# EAGLE board permamote-lte (EAGLE 9.6.1)
REV: C
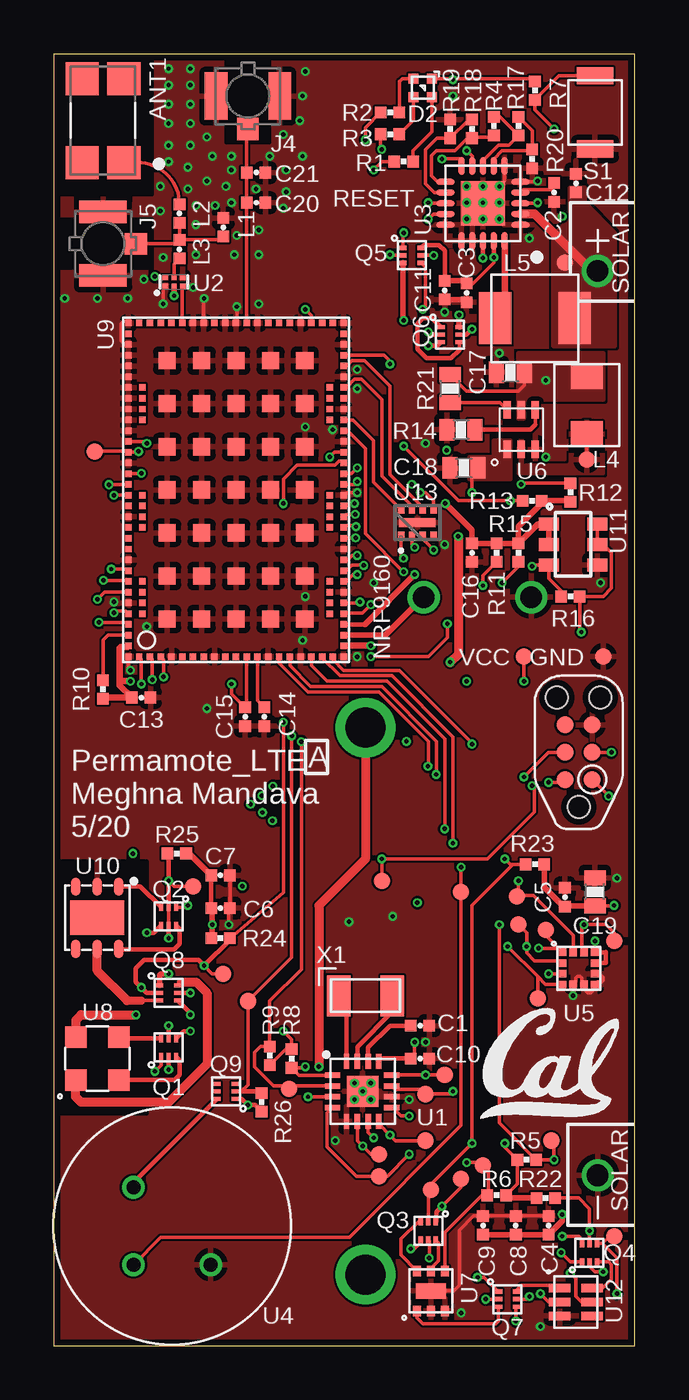
[diagram p5: board, top side]
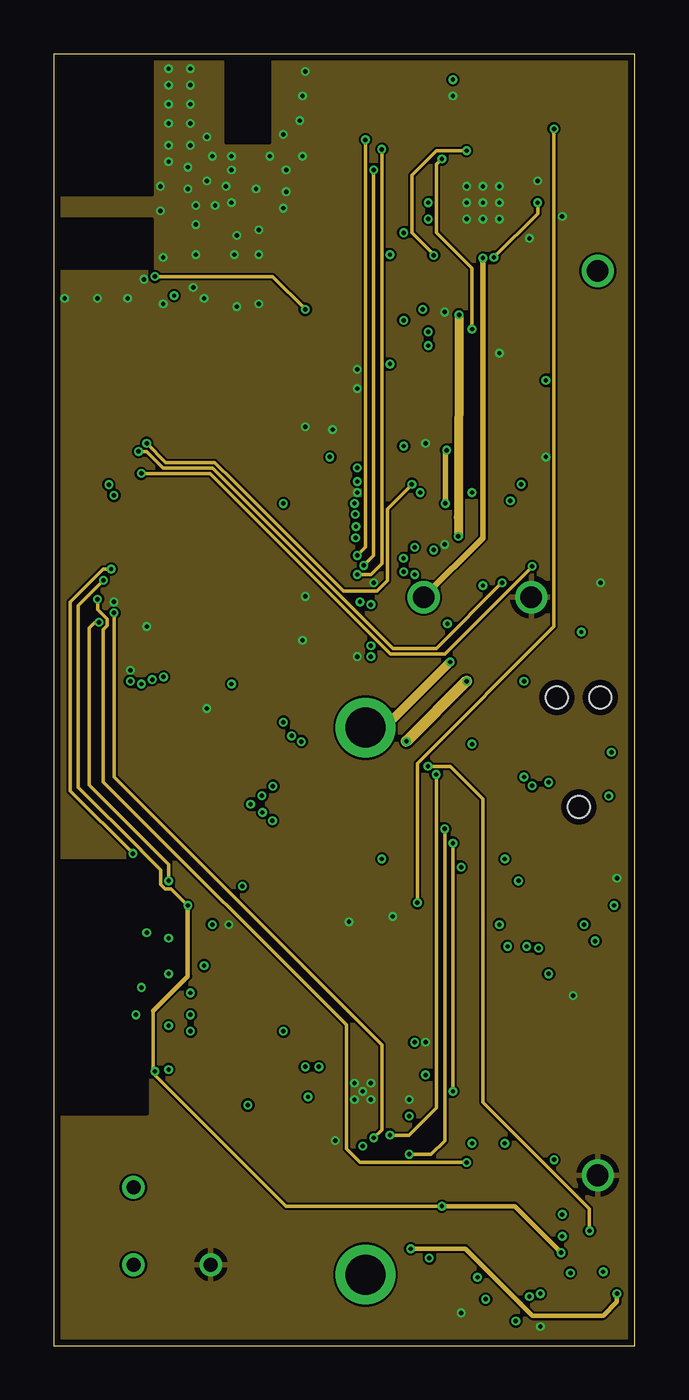
[diagram p6: board, inner layer Route2]
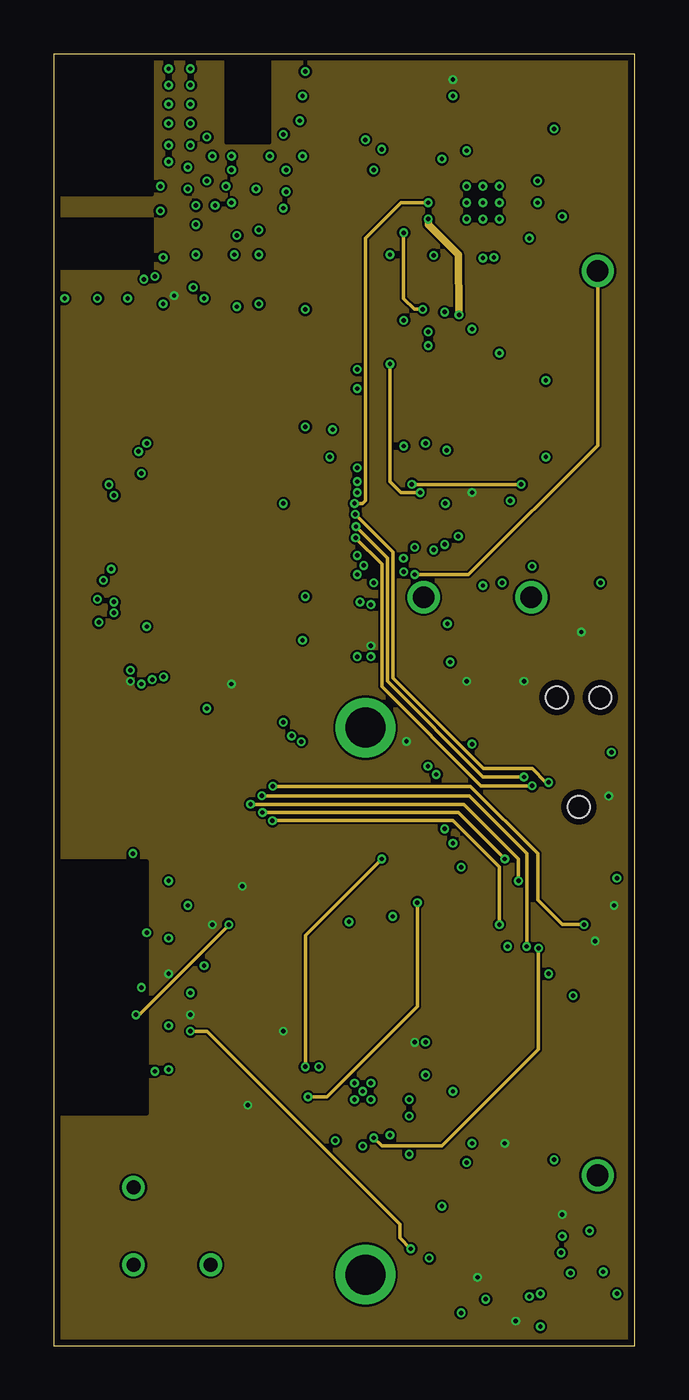
[diagram p7: board, inner layer Route15]
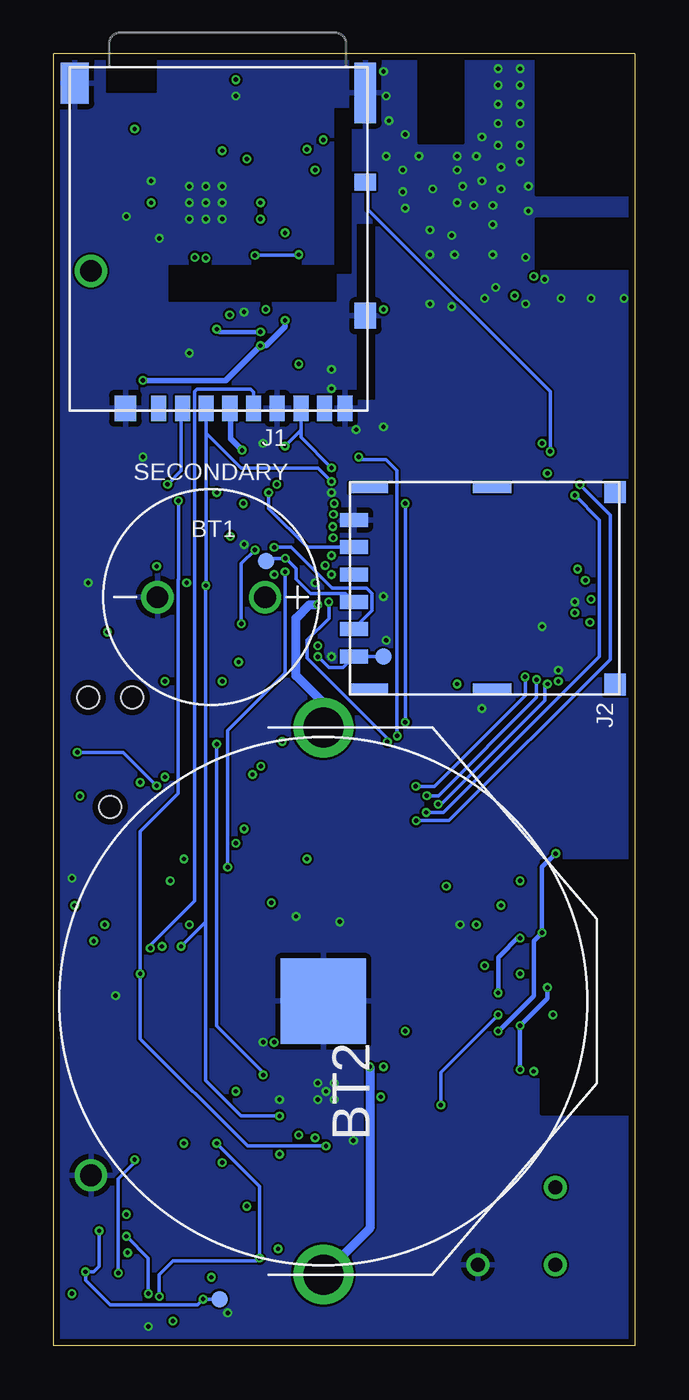
[diagram p8: board, bottom side, seen from below]

Size 27 x 60 mm. Coordinates in mm from the lower left corner, seen from the top.
Outline: 0.5,60 0,60 0,0 27,0 27,60 0.47,60
Copper layers (1+2*15+16): Top 0.0178mm / dielectric 59mil / Route2 0.0356mm / dielectric 0.1499mm / Route15 0.0356mm / dielectric 0.2007mm / Bottom 0.0178mm
Design rules "quickturn_co_kr_1oz_4lyr *": minimum track width 4mil, minimum drill 8mil, track to track 4mil, track to pad 4mil, pad to pad 4mil, via to via 4mil, smd to smd 4mil, copper to edge 12mil, drill to drill 12mil, minimum pad ring 8mil, minimum via ring 4mil, stop-mask expansion 3mil, vias tented up to drill 50mil, thermal gap 10mil
tKeepout: area 24.9,18 to 25.4,18
tRestrict: area 24.4,16.5 to 24.4,17; area 24.9,16.5 to 24.9,17; area 24.9,17 to 25.4,17; area 17.8,1.3 to 17.9,1.9

## Footprints (pad centres in the part's own frame; a part is rotated, then mirrored left to right if it is on the bottom)
ANT_1462350001 = smd 1.54 x 1.54: 1 -1.95,-0.97; 2 1.95,-0.97; 3 1.95,0.97; 4 -1.95,0.97
1020 = drill 1: + -2.5,0; - 2.5,0
2477THMCOINCLIP = drill 1.854: 1 -12.7,0; 2 12.7,0 | smd 3.962 x 3.962: GND 0,0
0402_CAP = smd 0.536 x 0.546: 1 -0.433,0; 2 0.433,0
0603_CAP = smd 0.7 x 1: 1 -0.65,0; 2 0.65,0
SOLAR_HOLES = drill 1: + 0,0; - 42,0
1MM_SQ_4PAD = smd 0.457 x 0.457: 1 0.432,0.432; 2 0.432,-0.432; 3 -0.432,-0.432; 4 -0.432,0.432
DM3AT-SF-PEJM5 = smd 0.7 x 1.2: 1 3.2,-0.1; 2 2.1,-0.1; 3 1,-0.1; 4 -0.1,-0.1; 5 -1.2,-0.1; 6 -2.3,-0.1; 7 -3.4,-0.1; 8 -4.5,-0.1; B -5.45,-0.1 | smd 1 x 0.8: A -6.4,-10.6 | smd 1 x 1.2: MOUNT0 4.75,-0.1; MOUNT1 -6.4,-4.4 | smd 1 x 2.8: MOUNT2 -6.4,-14.75 | smd 1.3 x 1.9: MOUNT3 7.1,-15.2
WURTH_NANO_SIM = smd 0.65 x 1.3: C1 1.905,6.07; C2 -0.635,6.07; C3 -1.905,6.07; C5 3.175,6.07; C6 0.635,6.07; C7 -3.175,6.07 | smd 1.03 x 1: P$8 -4.465,-6.07; P$9 4.465,-6.07 | smd 0.48 x 1.8: P$10 -4.66,-0.35; P$11 4.66,-0.35; P$12 -4.66,5.4; P$13 4.66,5.4
TC2030-IDC-NL = smd 0.787 x 0.787: 1 -1.27,-0.635; 2 -1.27,0.635; 3 0,-0.635; 4 0,0.635; 5 1.27,-0.635; 6 1.27,0.635 | hole 1.016: -2.54,0; 2.54,1.016; 2.54,-1.016
U.FL_SMT = smd 1.05 x 2.2: GND1 -1.475,0; GND2 1.475,0 | smd 1 x 1.05: SIG 0,-1.525
IHL-1212BZ-11 = smd 1.2 x 1.5: P$1 -1.35,0; P$2 1.35,0
74437324220 = smd 1.5 x 2.4: P$1 1.85,0; P$2 -1.85,0
XDFN-6 = smd 0.35 x 0.2: 1 -0.425,0.35; 2 -0.425,0; 3 -0.425,-0.35; 4 0.425,-0.35; 5 0.425,0; 6 0.425,0.35
0402_RES = smd 0.536 x 0.546: 1 -0.433,0; 2 0.433,0
0603-RES = smd 0.7 x 1: 1 -0.65,0; 2 0.65,0
B3U-1000P = smd 0.8 x 1.7: 1 -1.7,0; 2 1.7,0
PAD.03X.03 = smd 0.762 x 0.762: P$1 0,0
QFN-16-3MM = smd 0.7 x 0.25: 1 -1.4,0.75; 2 -1.4,0.25; 3 -1.4,-0.25; 4 -1.4,-0.75; 9 1.35,-0.75; 10 1.35,-0.25; 11 1.35,0.25; 12 1.35,0.75 | smd 0.25 x 0.7: 5 -0.75,-1.4; 6 -0.25,-1.4; 7 0.25,-1.4; 8 0.75,-1.4; 13 0.75,1.4; 14 0.25,1.4; 15 -0.25,1.4; 16 -0.75,1.4 | smd 1.45 x 1.45: GND 0,0
LNA-TSLP-6-2-ORIG = smd 0.25 x 0.25: 1 -0.2,0.4; 2 -0.2,0; 3 -0.2,-0.4; 4 0.2,-0.4; 5 0.2,0; 6 0.2,0.4
S-PVQFN-N20-RGR = smd 0.28 x 0.85: 1 -1,-1.74; 2 -0.5,-1.74; 3 0,-1.74; 4 0.5,-1.74; 5 1,-1.74; 11 1,1.74; 12 0.5,1.74; 13 0,1.74; 14 -0.5,1.74; 15 -1,1.74 | smd 0.85 x 0.28: 6 1.74,-1; 7 1.74,-0.5; 8 1.74,0; 9 1.74,0.5; 10 1.74,1; 16 -1.74,1; 17 -1.74,0.5; 18 -1.74,0; 19 -1.74,-0.5; 20 -1.74,-1 | smd 2.05 x 2.05: PAD 0,0
AMN2 = drill 0.65: GND 1.796,-1.796; OUT -1.796,-1.796; VCC -1.796,1.796
LGA-12 = smd 0.375 x 0.35: 1 -0.75,0.75; 2 -0.75,0.25; 3 -0.75,-0.25; 4 -0.75,-0.75; 7 0.75,-0.75; 8 0.75,-0.25; 9 0.75,0.25; 10 0.75,0.75 | smd 0.35 x 0.375: 5 -0.25,-0.75; 6 0.25,-0.75; 11 0.25,0.75; 12 -0.25,0.75
UDFN-6-MAXIM = smd 0.8 x 0.35: 1 -0.915,0.65; 2 -0.915,0; 3 -0.915,-0.65; 4 0.915,-0.65; 5 0.915,0; 6 0.915,0.65
UDFN-6-EXPOSED = smd 0.48 x 0.36: 1 -0.925,0.65; 2 -0.925,0; 3 -0.925,-0.65; 4 0.925,-0.65; 5 0.925,0; 6 0.925,0.65 | smd 0.71 x 1.4: EP 0,0
4-SMD = smd 1 x 1: 1 -1,1; 2 -1,-1; 3 1,-1; 4 1,1
NRF9160 = smd 0.3 x 0.3: ANT 15.75,4.75; AUX 15.75,6.25; COEX0 5.25,10.25; COEX1 5.75,10.25; COEX2 6.25,10.25; ENABLE 1.25,10.25; GND_SHIELD@1 0.25,10.25; GND_SHIELD@2 0.25,8.25; GND_SHIELD@3 0.25,6.25; GND_SHIELD@4 0.25,3.75; GND_SHIELD@5 0.25,2.25; GND_SHIELD@6 0.25,0.25; GND_SHIELD@7 3.25,0.25; GND_SHIELD@8 5.25,0.25; GND_SHIELD@9 7.75,0.25; GND_SHIELD@10 10.25,0.25; GND_SHIELD@11 11.75,0.25; GND_SHIELD@12 13.25,0.25; GND_SHIELD@13 14.75,0.25; GND_SHIELD@14 15.75,0.25; GND_SHIELD@15 15.75,2.25; GND_SHIELD@16 15.75,4.25; GND_SHIELD@17 15.75,5.25; GND_SHIELD@18 15.75,5.75; GND_SHIELD@19 15.75,6.75; GND_SHIELD@20 15.75,7.25; GND_SHIELD@21 15.75,10.25; GND_SHIELD@22 14.75,10.25; GND_SHIELD@23 14.25,10.25; GND_SHIELD@24 13.75,10.25; GND_SHIELD@25 13.25,10.25; GND_SHIELD@26 12.75,10.25; GND_SHIELD@27 12.25,10.25; GND_SHIELD@28 11.75,10.25; GND_SHIELD@29 11.25,10.25; GND_SHIELD@30 10.75,10.25; GND_SHIELD@31 9.25,10.25; GND_SHIELD@32 6.75,10.25; GND_SHIELD@33 4.75,10.25; GND_SHIELD@34 2.75,10.25; GPS 15.75,7.75; IO_SUPPLY 0.25,4.25; MAGPIO0 15.75,1.75; MAGPIO1 15.75,1.25; MAGPIO2 15.75,0.75; NC1 0.25,7.75; NC2 0.25,7.25; NC3 0.25,6.75; NC4 0.25,5.75; NC5 0.25,5.25; NC6 15.25,0.25; NC7 15.75,8.25; NC8 15.75,8.75; NC9 15.75,9.25; NC10 15.75,9.75; NC11 15.25,10.25; NC12 2.25,0.9; NC13 2.75,0.9; NC14 3.25,0.9; NC15 3.75,0.9; NC16 6.25,0.9; NC17 6.75,0.9; NC18 7.25,0.9; NC19 7.75,0.9; NC20 11.25,0.9; NC21 11.75,0.9; NC22 12.25,0.9; NC23 12.75,0.9; NC24 12.75,9.6; NC25 12.25,9.6; NC26 11.75,9.6; NC27 11.25,9.6; NC28 7.75,9.6; NC29 7.25,9.6; NC30 6.75,9.6; NC31 6.25,9.6; NC32 3.75,9.6; NC33 3.25,9.6; NC34 2.75,9.6; NC35 2.25,9.6; NRESET 5.75,0.25; P0.00 4.25,10.25; P0.01 3.75,10.25; P0.02 3.25,10.25; P0.03 2.25,10.25; P0.04 1.75,10.25; P0.05 0.25,9.75; P0.06 0.25,9.25; P0.07 0.25,8.75; P0.08 0.25,3.25; P0.09 0.25,2.75; P0.10 0.25,1.75; P0.11 0.25,1.25; P0.12 0.25,0.75; P0.13 1.25,0.25; P0.14 1.75,0.25; P0.15 2.25,0.25; P0.16 2.75,0.25; P0.17 3.75,0.25; P0.18 4.25,0.25; P0.19 4.75,0.25; P0.20 7.25,0.25; P0.21 8.25,0.25; P0.22 8.75,0.25; P0.23 9.25,0.25; P0.24 9.75,0.25; P0.25 10.75,0.25; P0.26 10.25,10.25; P0.27 9.75,10.25; P0.28 8.75,10.25; P0.29 8.25,10.25; P0.30 7.75,10.25; P0.31 7.25,10.25; SCLK 15.75,3.25; SDATA 15.75,3.75; SIM_1V8 14.25,0.25; SIM_CLK 12.75,0.25; SIM_DET 12.25,0.25; SIM_IO 13.75,0.25; SIM_RST 11.25,0.25; SWDCLK 6.25,0.25; SWDIO 6.75,0.25; VDD@1 0.75,0.25; VDD@2 0.75,10.25; VDD_GPIO 0.25,4.75; VIO 15.75,2.75 | smd 0.8 x 0.8: GND@1 2,8.45; GND@2 4,8.45; GND@3 6,8.45; GND@4 8,8.45; GND@5 10,8.45; GND@6 12,8.45; GND@7 14,8.45; GND@8 2,6.85; GND@9 4,6.85; GND@10 6,6.85; GND@11 8,6.85; GND@12 10,6.85; GND@13 12,6.85; GND@14 14,6.85; GND@15 2,5.25; GND@16 4,5.25; GND@17 6,5.25; GND@18 8,5.25; GND@19 10,5.25; GND@20 12,5.25; GND@21 14,5.25; GND@22 2,3.65; GND@23 4,3.65; GND@24 6,3.65; GND@25 8,3.65; GND@26 10,3.65; GND@27 12,3.65; GND@28 14,3.65; GND@29 2,2.05; GND@30 4,2.05; GND@31 6,2.05; GND@32 8,2.05; GND@33 10,2.05; GND@34 12,2.05; GND@35 14,2.05
DFN-6/3MM = smd 0.85 x 0.45: 1 -1.45,1; 2 -1.45,0; 3 -1.45,-1; 4 1.45,-1; 5 1.45,0; 6 1.45,1 | smd 1.6 x 2.5: P$1 0,0
TSOT23-6 = smd 0.6 x 0.927: 1 -0.95,-1.126; 2 0,-1.126; 3 0.95,-1.126; 4 0.95,1.126; 5 0,1.126; 6 -0.95,1.126
FN-6 = smd 1 x 0.4: 1 -0.75,0.65; 2 -0.75,0; 3 -0.75,-0.65; 4 0.75,-0.65; 5 0.75,0; 6 0.75,0.65
DPV8_1P7X0P4 = smd 0.38 x 0.3: 1 -0.61,0.75; 2 -0.61,0.25; 3 -0.61,-0.25; 4 -0.61,-0.75; 5 0.61,-0.75; 6 0.61,-0.25; 7 0.61,0.25; 8 0.61,0.75 | smd 0.4 x 1.7: 9 0,0
2-SMD = smd 1.092 x 1.905: 1 -1.245,0; 2 1.245,0

## Placement (x,y rotation side)
ANT1  1462350001  [ANT_1462350001]  2.29,56.9 90 top
BT1  LTOHTC1020  [1020]  19.68,34.77 180 bottom
BT2  2477THMCOINCELLCLIP  [2477THMCOINCLIP]  14.48,16 90 bottom
C1  47pF  [0402_CAP]  17.02,14.86 0 top
C2  10nF  [0402_CAP]  23.24,53.56 270 top
C3  10nF  [0402_CAP]  19.18,48.9 270 top
C4  0.1uF  [0402_CAP]  22.99,5.59 90 top
C5  0.1uF  [0402_CAP]  23.75,20.83 90 top
C6  0.1uF  [0402_CAP]  7.75,20.32 0 top
C7  0.1uF  [0402_CAP]  7.75,21.84 0 top
C8  1uF  [0402_CAP]  21.46,5.59 90 top
C9  1uF  [0402_CAP]  19.94,5.59 90 top
C10  1uF  [0402_CAP]  17.02,13.34 0 top
C11  4.7uF  [0402_CAP]  18.16,49.02 270 top
C12  4.7uF  [0402_CAP]  24.26,53.99 90 top
C13  4.7uF  [0402_CAP]  4.06,30.1 0 top
C14  4.7uF  [0402_CAP]  9.78,29.21 270 top
C15  4.7uF  [0402_CAP]  8.89,29.21 270 top
C16  4.7uF  [0402_CAP]  19.43,36.83 270 top
C17  10uF  [0603_CAP]  21.21,45.21 180 top
C18  10uF  [0603_CAP]  19.05,40.77 180 top
C19  10uF  [0603_CAP]  25.15,21.08 90 top
C20  DNP  [0402_CAP]  9.4,53.09 180 top
C21  DNP  [0402_CAP]  9.4,54.48 180 top
D1  SOLARCELLHOLES  [SOLAR_HOLES]  25.27,49.91 270 top
D2  SML-LX0404SIUPGUSB  [1MM_SQ_4PAD]  17.14,58.42 0 top
J1  DM3AT-SF-PEJM5  [DM3AT-SF-PEJM5]  18.92,43.43 180 bottom
J2  NANO_SIM  [WURTH_NANO_SIM]  6.99,35.18 90 bottom
J3  TC2030-JLINK-NL  [TC2030-IDC-NL]  24.38,27.56 90 top
J4  U.FL-R-SMT  [U.FL_SMT]  9.02,58.04 0 top
J5  U.FL-R-SMT  [U.FL_SMT]  2.29,51.18 90 top
L1  1.8nH  [0402_CAP]  7.87,51.94 270 top
L2  5.1nH  [0402_CAP]  5.84,52.58 90 top
L3  7.5nH  [0402_CAP]  5.84,50.93 90 top
L4  1uH  [IHL-1212BZ-11]  24.77,43.69 270 top
L5  22uH  [74437324220]  22.35,47.72 180 top
Q1  PMDXB950UPEL  [XDFN-6]  5.33,13.84 90 top
Q2  PMDXB950UPEL  [XDFN-6]  5.33,19.94 270 top
Q3  PMDXB950UPEL  [XDFN-6]  17.4,5.33 270 top
Q4  PMDXB950UPEL  [XDFN-6]  24.89,4.32 90 top
Q5  PMDXB950UPEL  [XDFN-6]  16.64,50.64 0 top
Q6  PMDXB950UPEL  [XDFN-6]  18.41,46.96 0 top
Q7  PMDXB950UPEL  [XDFN-6]  21.08,2.16 0 top
Q8  PMDXB950UPEL  [XDFN-6]  5.33,16.38 0 top
Q9  PMDXB950UPEL  [XDFN-6]  8,11.81 180 top
R1  470  [0402_RES]  16.26,54.99 180 top
R2  470  [0402_RES]  15.62,57.28 180 top
R3  470  [0402_RES]  15.62,56.26 180 top
R4  6.04k  [0402_RES]  20.45,56.64 90 top
R5  10k  [0402_RES]  21.97,8.64 180 top
R6  10k  [0402_RES]  20.57,6.99 0 top
R7  10k  [0402_RES]  22.35,58.29 90 top
R8  10k  [0402_RES]  11.05,13.34 90 top
R9  10k  [0402_RES]  10.03,13.46 270 top
R10  10k  [0402_RES]  2.29,30.48 90 top
R11  10k  [0402_RES]  20.57,36.83 90 top
R12  10k  [0402_RES]  24,39.62 270 top
R13  10k  [0402_RES]  22.23,39.24 0 top
R14  80.6k  [0603-RES]  18.92,42.55 0 top
R15  100k  [0402_RES]  21.59,36.83 90 top
R16  100k  [0402_RES]  24,34.8 0 top
R17  3.9M  [0402_RES]  21.59,56.64 270 top
R18  6.2M  [0402_RES]  19.43,56.52 270 top
R19  6.8M  [0402_RES]  18.41,56.52 270 top
R20  9.1M  [0402_RES]  22.23,55.12 90 top
R21  33M  [0603-RES]  18.41,44.45 90 top
R22  100M  [0402_RES]  22.86,6.86 180 top
R23  100M  [0402_RES]  22.35,22.35 0 top
R24  100M  [0402_RES]  7.75,18.92 180 top
R25  100M  [0402_RES]  5.71,22.86 0 top
R26  100M  [0402_RES]  9.65,11.3 270 top
S1  B3U-1000P  [B3U-1000P]  25.15,57.28 90 top
TP1  TEST-POINT  [PAD.03X.03]  26.04,5.08 0 top
TP2  TEST-POINT  [PAD.03X.03]  18.92,7.75 0 top
TP3  TEST-POINT  [PAD.03X.03]  22.86,19.3 270 top
TP4  TEST-POINT  [PAD.03X.03]  15.11,8.89 0 top
TP5  TEST-POINT  [PAD.03X.03]  22.48,16.13 90 top
TP6  TEST-POINT  [PAD.03X.03]  18.16,12.57 0 top
TP7  TEST-POINT  [PAD.03X.03]  21.59,19.56 90 top
TP8  TEST-POINT  [PAD.03X.03]  7.87,17.27 0 top
TP9  TEST-POINT  [PAD.03X.03]  19.3,2.16 0 bottom
TP10  TEST-POINT  [PAD.03X.03]  17.53,7.24 0 top
TP11  TEST-POINT  [PAD.03X.03]  9.02,16 0 top
TP12  TEST-POINT  [PAD.03X.03]  6.48,21.34 0 top
TP13  TEST-POINT  [PAD.03X.03]  17.27,11.68 90 top
TP14  TEST-POINT  [PAD.03X.03]  15.11,7.87 0 top
TP15  TEST-POINT  [PAD.03X.03]  17.27,9.53 0 top
TP16  TEST-POINT  [PAD.03X.03]  10.92,11.94 0 top
TP17  TEST-POINT  [PAD.03X.03]  15.24,21.59 0 top
TP18  TEST-POINT  [PAD.03X.03]  21.51,20.87 0 top
TP19  TEST-POINT  [PAD.03X.03]  26.04,18.8 270 top
TP20  TEST-POINT  [PAD.03X.03]  23.11,9.53 0 top
TP21  TEST-POINT  [PAD.03X.03]  19.94,8.38 0 top
TP22  TEST-POINT  [PAD.03X.03]  18.92,21.08 90 top
TP23  TEST-POINT  [PAD.03X.03]  23.75,50.29 0 top
TP24  TEST-POINT  [PAD.03X.03]  24.77,41.15 0 top
TP25  TEST-POINT  [PAD.03X.03]  21.84,32 0 top
TP26  TEST-POINT  [PAD.03X.03]  25.53,32 0 top
TP27  TEST-POINT  [PAD.03X.03]  17.14,36.45 0 bottom
TP28  TEST-POINT  [PAD.03X.03]  11.68,32 270 bottom
TP29  TEST-POINT  [PAD.03X.03]  1.91,41.53 0 top
U1  AB1815-T3  [QFN-16-3MM]  14.35,11.81 0 top
U2  BGA725L6  [LNA-TSLP-6-2-ORIG]  5.59,49.4 90 top
U3  BQ25505  [S-PVQFN-N20-RGR]  19.94,53.05 90 top
U4  EKMB1101111  [AMN2]  5.5,5.56 0 top
U5  LIS2DW12  [LGA-12]  24.38,17.53 0 top
U6  MAX17222  [UDFN-6-MAXIM]  21.72,42.55 90 top
U7  MAX44009  [UDFN-6-EXPOSED]  17.53,2.54 90 top
U8  MS5637-02BA03  [4-SMD]  2.03,13.34 90 top
U9  NRF9160  [NRF9160]  13.72,31.75 90 top
U10  SI7021-A20-GM1  [DFN-6/3MM]  2.02,19.88 270 top
U11  SIP32510  [TSOT23-6]  24.13,37.21 270 top
U12  TCS34725  [FN-6]  24.26,2.03 0 top
U13  TPD3F303DPVR  [DPV8_1P7X0P4]  16.89,38.23 90 top
U$2  [UCB_CAL_200MIL]  19.81,10.54 0 top
X1  ABS07-32.768KHZ-7-T  [2-SMD]  14.48,16.26 0 top

## Tracks (layer width: path | path; a pad name or v marks a point on that pad's centre or on a via)
!CLR_EN  (via drill 0.2)
  Top 0.152: v25.53,3.43 25.15,3.43 24.89,3.68 Q4.2 | Q4.5 v24.89,5.33 24.89,6.35 24.38,6.86 R22.1 | U9.P0.08 10.47,31.7 11.81,30.35 15.11,30.35 17.4,28.07 17.4,26.92 v17.38,26.91 | Q7.2 v20.07,2.16
  Route2 0.152: v17.38,26.91 18.43,26.91 19.94,25.4 19.94,11.3 24.89,6.35 v24.89,5.33
  Bottom 0.152: v24.89,5.33 24.89,3.68 25.15,3.43 v25.53,3.43 25.53,3.05 24.38,1.91 20.32,1.91 v20.07,2.16 TP9.P$1
!CLR_INT  (via drill 0.2)
  Top 0.152: U12.5 24.51,2.03 24.26,2.29 24.26,3.12 v24,3.38 | U9.P0.29 v2.56,40 v2.56,39.99 | TP20.P$1 23.24,9.4 v23.24,8.64 R5.1 20.7,10.34 v20.7,19.56
  Route15 0.152: v20.7,19.56 20.7,22.23 18.54,24.38 v10.16,24.38
  Bottom 0.152: v23.24,8.64 23.24,8.51 24,7.75 v24,3.38 | v2.56,39.99 1.14,38.58 1.14,31.88 8.64,24.38 v10.16,24.38
!HUM_EN  (via drill 0.2)
  Top 0.152: v2.09,33.59 3.37,33.59 U9.P0.04 | TP12.P$1 5.59,21.34 v5.33,21.59 | Q2.2 Q2.5
  Top 0.203: Q2.5 v5.33,18.92 | Q8.5 v6.35,16.38 | Q2.2 v5.33,21.59 5.33,22.81 R25.1
  Route2 0.152: v2.09,33.59 1.91,33.59 1.65,33.34 1.65,26.04 5.33,22.35 v5.33,21.59
  Bottom 0.203: v5.33,18.92 5.33,19.05 6.35,18.03 v6.35,16.38
!LT_EN  (via drill 0.2)
  Top 0.152: Q3.5 17.44,4.86 v17.44,4.06 | v22.1,2.29 21.97,2.16 Q7.5 | Q3.2 17.4,7.11 TP10.P$1 17.53,7.49 v19.43,9.4 19.43,20.45 21.34,22.35 | R23.1 21.34,22.35 | 21.34,22.35 21.21,22.35 v20.95,22.61 | U9.P0.30 v2.79,39.5
  Route15 0.152: v20.95,22.61 18.8,24.77 v9.7,24.77
  Bottom 0.152: v19.43,9.4 17.44,7.41 v17.44,4.06 17.57,3.94 21.46,3.94 22.1,3.3 v22.1,2.29 | v2.79,39.5 1.65,38.35 1.65,32 8.89,24.77 v9.7,24.77
!LT_INT  (via drill 0.2)
  Top 0.152: U7.4 18.18,5.27 19.89,6.99 R6.1 20.19,7.04 20.19,8.13 TP21.P$1 19.81,8.51 v19.18,8.51 | U9.P0.02 2.36,35 v2.03,34.67
  Route2 0.152: v2.03,34.67 2.03,34.19 2.47,33.75 2.47,33.44 2.29,33.25 2.29,26.19 13.59,14.89 13.59,9.14 14.22,8.51 v19.18,8.51
!PIR_EN  (via drill 0.2)
  Top 0.152: U9.P0.24 13.05,41.5 v12.83,41.27 | v11.05,28.32 11.05,18.03 TP11.P$1 9.02,12.12 8.71,11.81 Q9.2
  Top 0.203: Q9.2 9.58,11.81 R26.1
  Bottom 0.152: v11.05,28.32 11.05,40.64 11.56,41.15 12.7,41.15 v12.83,41.27
!PR_EN  (via drill 0.2)
  Top 0.152: v6.99,17.65 7.37,17.27 TP8.P$1 | R24.1 10.67,21.06 v10.67,28.96 | U9.P0.23 13.38,41.08 13.24,41.08 13.05,40.89 11.3,40.89 10.67,40.26 v10.67,39.12
  Top 0.203: Q1.5 v5.33,14.86 | Q1.2 v5.33,12.83 | Q8.2 4.32,16.38 v4.06,16.64 3.81,16.89 3.81,17.53 4.19,17.91 6.73,17.91 v6.99,17.65 8.18,18.85 R24.1
  Bottom 0.152: v10.67,39.12 v10.67,28.96
  Bottom 0.203: v5.33,12.83 v5.33,14.86 4.06,16.13 v4.06,16.64
!RST  (via drill 0.2)
  Top 0.152: U1.1 11.39,12.56 R8.1 11.63,12.9 v11.68,12.95 | U9.NRESET 13.48,37.52 v14.02,37.52 | TP17.P$1 v15.24,22.61 20.15,22.61 22.33,24.79 22.33,25.9 v22.23,26 | v25.91,27.56 J3.3
  Route15 0.152: v14.02,37.52 15.24,36.3 15.24,30.61 19.84,26 v22.23,26 | v15.24,22.61 11.68,19.05 v11.68,12.95
  Bottom 0.152: v22.23,26 23.78,27.56 v25.91,27.56
!RTC_EXTR  (via drill 0.2)
  Top 0.152: v23.24,56.52 22.35,57.4 R7.1 23.47,58.98 S1.2 | U1.3 v11.81,11.56
  Route2 0.152: v23.24,56.52 23.24,33.4 16.89,27.05 v16.89,20.57
  Route15 0.152: v16.89,20.57 16.89,15.75 12.7,11.56 v11.81,11.56
!RTC_IRQ1  (via drill 0.2)
  Top 0.152: U1.11 15.85,11.91 17.04,11.91 TP13.P$1 18.41,11.68 v18.54,11.81 | U9.P0.11 12.47,31.95 13.3,31.11 15.7,31.11 18.54,28.28 v18.54,23.34
  Route2 0.152: v18.54,23.34 v18.54,11.81
!RTC_IRQ2  (via drill 0.2)
  Top 0.152: U9.P0.10 11.97,31.59 12.7,30.86 15.47,30.86 18.16,28.17 v18.16,24 | U1.4 12.7,10.81 12.7,9.24 14.07,7.87 TP14.P$1 15.49,7.87 v16.51,8.89
  Route2 0.152: v18.16,24 18.16,9.53 17.53,8.89 v16.51,8.89
!RTC_IRQ3  (via drill 0.2)
  Top 0.152: U1.8 15.1,10.3 v15.62,9.78 15.88,9.53 TP15.P$1 | v17.77,26.53 17.78,26.54 17.78,28.07 15.24,30.61 11.94,30.61 10.97,31.58 U9.P0.09
  Route2 0.152: v17.77,26.53 17.78,26.53 17.78,11.05 16.51,9.78 v15.62,9.78
!SD_CS  (via drill 0.2)
  Top 0.152: v4.32,41.91 4.23,42 U9.P0.26 | R12.1 21.77,40.06 v21.72,40.01
  Route2 0.152: v4.32,41.91 5.21,41.02 7.48,41.02 8.37,40.13 8.38,40.13 13.46,35.05 15.02,35.05 15.49,35.53 15.49,38.86 v16.64,40.01
  Route15 0.152: v21.72,40.01 v16.64,40.01
  Bottom 0.152: J1.2 21.08,43.48 21.08,40.64 v21.72,40.01
!SD_DETECT  (via drill 0.2)
  Top 0.152: v3.94,41.53 3.91,41.5 U9.P0.27 3.42,41.55 1.92,41.55 TP29.P$1 | R15.1 21.59,36.19 v20.83,35.43
  Route2 0.152: v3.94,41.53 4.32,41.53 5.08,40.77 7.38,40.77 15.76,32.38 17.78,32.38 v20.83,35.43
  Bottom 0.152: J1.A 12.4,53.91 12.4,52.76 3.94,44.3 v3.94,41.53
!VBAT_PRI_ON  (via drill 0.2)
  Top 0.152: v18.03,55.12 18.94,55.12 U3.10
  Top 0.203: Q6.2 17.53,46.96 v17.4,47.09 | v19.43,47.21 19.18,46.96 Q6.5
  Route2 0.152: v19.43,47.21 19.43,50.04 17.78,51.69 17.78,54.86 v18.03,55.12
  Bottom 0.203: v17.4,47.09 19.3,47.09 v19.43,47.21
!VBAT_SEC_ON  (via drill 0.2)
  Top 0.152: Q5.5 v17.65,50.64 | v19.18,55.5 19.44,55.24 U3.9 | v15.62,50.67 15.65,50.64 Q5.2
  Route2 0.152: v19.18,55.5 17.78,55.5 16.64,54.36 16.64,51.69 17.65,50.67 v17.65,50.64
  Bottom 0.152: v17.65,50.64 15.65,50.64 v15.62,50.67
ACC_CS  (via drill 0.2)
  Top 0.152: U5.2 23.54,17.87 22.34,17.87 21.97,18.24 v21.97,18.54 21.97,19.18 TP7.P$1 | U9.P0.06 4.57,31.89 v4.57,30.93
  Route15 0.152: v21.97,18.54 21.97,22.86 19.3,25.53 9.67,25.53 v9.67,25.54
  Bottom 0.152: v4.57,30.93 4.57,30.1 9.13,25.54 v9.67,25.54
ACC_INT1  (via drill 0.2)
  Top 0.152: U5.12 24.13,19.05 22.28,20.9 21.54,20.9 TP18.P$1 21.59,20.95 v21.59,21.59 | U9.P0.05 4.06,31.9 v4.06,30.73
  Route15 0.152: v9.14,25.15 19.05,25.15 21.59,22.61 v21.59,21.59
  Bottom 0.152: v4.06,30.73 4.19,30.61 4.19,29.97 9.02,25.15 v9.14,25.15
ACC_INT2  (via drill 0.2)
  Top 0.152: U5.11 24.54,18.37 24.54,19.46 v24.64,19.56 25.65,19.56 26.04,19.18 TP19.P$1 | U9.P0.07 5.1,31.87 v5.1,31.06
  Route15 0.152: v10.18,25.98 19.36,25.98 22.48,22.86 22.48,20.7 23.62,19.56 v24.64,19.56
  Bottom 0.152: v5.1,31.06 5.1,30.21 9.32,25.98 v10.18,25.98
GND  (via drill 0.2)
  Top 0.152: v3.56,31.37 3.47,31.46 U9.GND_SHIELD@1 | U7.EP 18.6,2.54 18.85,2.79 18.85,5.37 19.5,6.02 C9.2 C8.2 C4.2 | v24.13,16.26 U5.5 | U5.5 24.24,16.89 24.24,17.07 24.32,17.14 24.45,17.14 24.52,17.07 24.52,16.89 U5.6 24.74,16.67 24.74,16.46 24.81,16.38 24.95,16.38 25.02,16.46 25.02,16.66 U5.7 25.25,16.89 25.45,16.89 25.53,16.96 25.53,17.1 25.45,17.17 25.24,17.17 U5.8 | v8.13,19.56 8.13,20.27 C6.2 C7.2 | U3.6 20.94,54.09 v20.7,53.85 | U9.GND_SHIELD@21 3.38,47.58 3.24,47.58 3.14,47.48 3.14,46.65 3.29,46.5 U9.GND_SHIELD@22 | U9.GND_SHIELD@19 6.97,48.62 arc-90 v6.99,48.64 | v5.08,48.39 5.08,49.09 U2.1 | U9.GND_SHIELD@9 13.59,39.62 v14.1,39.62 | v8.51,48.26 8.51,47.54 U9.GND_SHIELD@17 | v22.48,54.1 22.43,54.05 U3.5
  Top 0.254: U5.8 | U5.5 | C11.2 19.05,48.59 C3.2
  Top 0.406: U8.4 1.03,15.13 1.27,15.37 v3.81,15.37
  Route15 0.152: v8.13,19.56 8.13,19.53 3.97,15.37 v3.81,15.37
  other vias: 19.18,53.85 19.94,53.85 20.7,53.09 19.94,53.09 19.18,53.09 19.18,52.32 19.94,52.32 20.7,52.32 14.35,11.81 13.97,12.19 14.73,12.19 14.73,11.43 13.97,11.43 2.03,48.64 6.48,49.15 22.86,41.27 16.51,11.43 17.27,14.1 18.92,1.52 22.61,0.89 26.16,21.72 4.32,33.4 11.68,34.8 7.11,29.59 2.79,34.54 14.86,35.43 14.1,45.34 11.56,32.77 14.1,32 25.4,35.43 8.38,50.67 9.53,48.39 9.53,50.67 5.08,50.55 6.6,50.67 9.4,53.72 7.49,52.96 4.19,49.53 8.51,51.56 9.53,51.82 10.67,52.83 8.26,53.09 8,53.85 10.79,53.59 8.26,54.61 10.79,54.61 3.43,48.64 4.95,52.7 6.6,52.07 6.6,52.96 6.22,53.72 5.33,54.99 6.22,54.74 0.51,48.64 4.95,53.85 7.11,56.13 7.37,55.24 8.26,55.24 10.03,55.24 11.56,55.24 11.68,59.18 6.35,59.31 5.33,59.31 5.33,58.55 6.35,58.55 6.35,57.66 5.33,57.66 5.33,56.77 6.35,56.77 6.35,55.75 5.33,55.75 7.11,54.1 11.56,58.04 11.43,56.9 10.67,56.26 13.08,9.53 11.68,42.67 12.95,42.55 14.1,44.45 22.1,51.44 18.16,48.01 13.72,19.68 15.75,19.94 23.62,52.45 18.54,58.04 18.16,37.21 17.27,41.91 20.7,46.1
  pour Top (rank 2): 0,60 27,60 27,0 0,0
  pour Bottom (rank 2): 0,60 27,60 27,0 0,0
  pour Route2 (rank 2): 0,60 0,0 27,0 27,60
GPS_EN  (via drill 0.2)
  Top 0.152: v4.7,49.66 4.75,49.6 U2.6 | v11.68,48.13 11.97,47.85 U9.MAGPIO0
  Route2 0.152: v4.7,49.66 10.16,49.66 v11.68,48.13
LBST
  Top 0.152: U3.20 20.95,51.3
  Top 0.305: 20.95,51.3 20.95,48.17
  Top 0.406: 20.95,48.17 L5.P$1
LED_BLUE  (via drill 0.2)
  Top 0.152: v15.24,55.56 15.19,55.74 R3.2 | v14.1,35.81 13.91,35.81 13.59,35.5 U9.P0.17
  Route2 0.152: v15.24,55.56 15.24,36.32 14.73,35.81 v14.1,35.81
LED_GREEN  (via drill 0.2)
  Top 0.152: R2.2 14.48,56.57 v14.48,56.01 | v14.1,36.7 13.84,36.7 | 13.84,36.7 | 13.84,36.7 13.64,36.5 U9.P0.19
  Route2 0.152: v14.1,36.7 14.48,37.08 v14.48,56.01
LED_RED  (via drill 0.2)
  Top 0.152: U9.P0.18 13.59,36 13.85,36.25 14.38,36.25 v14.39,36.24 | R1.2 15.24,54.99 v14.86,54.61
  Route2 0.152: v14.39,36.24 14.86,36.7 v14.86,54.61
MISO  (via drill 0.2)
  Top 0.152: U5.3 v22.99,17.27 | U9.P0.22 13.83,40.5 v14.1,40.77 | TP4.P$1 14.73,8.89 v14.35,9.27 14.1,9.52 U1.6 | v16.26,41.78 18.8,39.24 v21.21,39.24 R13.1
  Bottom 0.152: v14.1,40.77 15.52,42.19 J1.7 15.52,42.52 v16.26,41.78 | v14.35,9.27 18,9.27 22.99,14.26 v22.99,17.27 22.96,17.27 22.99,17.3 22.99,23.88 21.21,25.65 21.21,35.59 v21.21,39.24
MOSI  (via drill 0.2)
  Top 0.152: v16.51,10.67 16.13,10.67 15.74,11.06 U1.9 | v21.08,18.54 22.48,17.14 | 22.48,17.14 22.85,16.78 U5.4 | TP5.P$1 22.48,17.14 | v14.1,40.13 13.96,40 U9.P0.21 | v19.94,35.31 19.94,35.76 R11.1
  Bottom 0.152: v14.1,40.13 14.73,40.77 18.3,40.77 19.92,42.39 J1.3 19.92,35.32 v19.94,35.31 19.94,19.68 | v16.51,10.67 18.29,10.67 19.94,12.32 19.94,19.68 | 19.94,19.68 v21.08,18.54
N$1
  Top 0.152: U9.GPS 5.97,48.61 5.97,49.18 U2.3
N$2
  Top 0.152: U2.5 5.59,50.24 L3.1
N$4
  Top 0.152: L2.1 L3.2 | L3.2 5.62,51.18 J5.SIG | L3.2 7.74,51.36 L1.2
N$5
  Top 0.152: L2.2 arc90 3.91,54.95 ANT1.1
N$8
  Top 0.152: U9.ANT C20.2 C21.2 8.96,56.46 J4.SIG
N$9
  cutout Top: 0,52.32 4.57,52.32 4.57,50.16 4.57,50.04 0,50.04
N$10
  cutout Top: 0,22.48 1.78,22.48 1.78,20.95 2.29,20.95 2.29,22.48 4.32,22.48 4.32,10.79 0,10.79
  cutout Route2: 0,22.48 1.78,22.48 2.29,22.48 4.32,22.48 4.32,10.79 0,10.79
  cutout Route15: 0,22.48 1.78,22.48 2.29,22.48 4.32,22.48 4.32,10.79 0,10.79
  cutout Bottom: 0,22.48 1.78,22.48 2.29,22.48 4.32,22.48 4.32,10.79 0,10.79
N$11
  cutout Route2: 0,52.32 4.57,52.32 4.57,50.04 0,50.04
N$12
  Top 0.152: 22.37,42.78 U6.4
  Top 0.203: 22.37,42.78 22.14,42.55 R14.2
N$13  (via drill 0.2)
  Top 0.254: U11.2 U11.1 22.5,38.16 21.98,37.64 21.97,37.64 R15.2 | R15.2 21.59,38.03 22.66,39.1 R13.2 23.95,39.24 R12.2 | R15.2 R11.2 C16.1 19.43,37.88 v18.19,39.12
  Route2 0.254: v18.25,41.59 18.19,41.53 v18.19,39.12
  Bottom 0.254: J1.4 18.8,43.51 18.8,42.13 v18.25,41.59
N$14
  Top 0.152: R21.1 20.73,43.8 U6.6
N$15
  Top 0.152: D2.2 17.58,56.39 16.69,55.5 R1.1
N$16
  cutout Top: 4.57,59.94 0,59.94 0,53.47 4.57,53.47
N$17
  Top 0.152: D2.4 16.2,58.85 16.08,58.73 16.05,58.73 R2.1
N$18
  Top 0.152: R17.1 22.23,56.44 R20.2 22.17,55.5 20.83,55.5 20.44,55.11 U3.7
N$19
  Top 0.152: D2.3 16.71,56.92 R3.1
N$20
  Top 0.152: U7.1 16.88,1.28 17.14,1.02 20.53,1.02 20.66,1.14 Q7.3
N$21
  Top 0.203: Q8.6 5.92,16.89
  Top 0.406: 5.92,16.89 6.6,16.89 7.11,16.38 7.11,13.08 5.33,11.3 1.27,11.3 1.02,11.56 1.02,12.32 U8.1
N$22
  Top 0.152: 4.06,16.03 Q8.3
  Top 0.381: 3.4,16.03 4.06,16.03
  Top 0.406: 3.4,16.03 2.02,17.41 U10.5
N$23
  Top 0.203: Q9.6 3.7,7.58 U4.VCC
N$24
  cutout Route2: 4.57,59.94 0,59.94 0,53.47 4.57,53.47
N$25
  Top 0.203: U1.14 14.61,13.84 15.62,14.86 C1.1
N$26
  cutout Route15: 4.57,53.47 0,53.47 0,59.94 4.57,59.94
N$27
  cutout Bottom: 4.57,53.47 0,53.47 0,59.94 4.57,59.94
N$28
  Top 0.152: R10.2 2.29,32.77 2.52,33 U9.ENABLE
N$29
  Top 0.152: U9.IO_SUPPLY 9.47,29.96 C14.1
N$30
  cutout Route15: 0,52.32 4.57,52.32 4.57,50.04 0,50.04
N$31
  Top 0.152: Q7.6 21.51,2.58 21.72,2.79 23.39,2.79 U12.1
N$32
  Top 0.152: U3.8 19.94,55.03 20.66,55.75 21.13,55.75 R17.2 20.72,57.08 R4.2
N$34
  Top 0.152: Q1.6
  Top 0.203: U8.3 3.1,14.27 Q1.6
N$35
  cutout Bottom: 4.57,52.32 0,52.32 0,50.04 4.57,50.04
N$36
  cutout Bottom: 8,59.94 8,55.88 10.03,55.88 10.03,59.94
N$37
  cutout Route15: 8,59.94 10.03,59.94 10.03,55.88 8,55.88
N$38
  cutout Route2: 8,59.94 10.03,59.94 10.03,55.88 8,55.88
N$39
  cutout Top: 10.03,59.94 8,59.94 8,55.88 10.03,55.88
N$40
  Top 0.203: U1.15 14.1,13.87 15.72,15.49 X1.2
N$41
  Top 0.203: U8.2 5.08,12.34 5.6,12.34 5.84,12.57 5.84,13.26 Q1.3
N$43
  Top 0.203: X1.1 13.6,15.89 U1.16
N$45  (via drill 0.2)
  Top 0.152: v17.14,48.13 17.27,48.26 17.27,50.08 Q5.4 | v16.26,51.69 16.21,51.65 Q5.1
  Route15 0.152: v17.14,48.13 16.76,48.13 16.26,48.64 v16.26,51.69
N$48
  Top 0.152: Q2.3
  Top 0.203: U10.1 4.02,21.32 Q2.3
N$50
  Top 0.152: Q2.6
  Top 0.203: U10.6 3.03,18.41 5.59,18.41 5.84,18.67 5.84,19.36 Q2.6
N$51
  Top 0.152: U7.6 16.13,4.21 16.13,4.95 16.93,5.76 Q3.3
N$52
  Top 0.152: Q3.6 17.88,4.78 17.88,3.94 17.53,3.59 U7.5
N$53
  Top 0.152: 18.84,46.24 Q6.4
  Top 0.203: Q6.1 17.58,47.72 17.14,47.72 16.89,47.47 16.89,46.28 17.32,45.86 18.46,45.86 18.84,46.24
N$54
  Top 0.152: U12.6 25.52,2.68 25.91,3.08 25.91,3.77 25.78,3.89 Q4.3
N$55  (via drill 0.2)
  Top 0.152: v22.61,2.41 22.99,2.03 U12.2 | Q4.6 24.54,4.92 24.38,5.08 v23.62,5.08
  Bottom 0.152: v23.62,5.08 22.61,4.06 v22.61,2.41
N$57
  Top 0.152: U3.12 17.69,53.55 17.27,53.98 17.27,55.55 17.8,56.08 R19.2 19.28,56.95 R18.1
N$58
  Top 0.152: U3.11 17.83,54.05 17.54,54.34 17.54,55.26 17.78,55.5 18.64,55.5 19.22,56.08 R18.2 19.48,56.13 20.36,56.13 R4.1
PIR_OUT  (via drill 0.2)
  Top 0.152: U4.OUT 4.97,5.03 13.73,5.03 18.92,10.22 TP22.P$1 v18.92,22.23 | U9.P0.25 13.63,42.5 14.48,41.66 14.48,37.72 v16.26,35.94
  Bottom 0.152: v18.92,22.23 18.92,28.57 16.26,31.24 v16.26,35.94
RTC_CS  (via drill 0.2)
  Top 0.152: U1.12 15.71,12.57 v17.27,12.57 TP6.P$1 | U9.P0.12 12.97,31.87 13.47,31.37 16.06,31.37 19.43,28 v19.43,27.94
  Bottom 0.152: v19.43,27.94 19.43,14.86 17.27,12.7 v17.27,12.57
SCK  (via drill 0.2)
  Top 0.152: U1.7 14.6,9.91 v14.86,9.65 | v2.79,34.04 2.88,34.13 3.34,34.13 U9.P0.03 | v22.52,18.46 23.45,18.46 U5.1 22.86,19.05 TP3.P$1
  Route2 0.152: v2.79,34.04 2.79,26.42 15.24,13.97 15.24,10.03 v14.86,9.65
  Route15 0.152: v22.52,18.46 22.52,13.76 18.03,9.27 15.24,9.27 v14.86,9.65
  Bottom 0.152: J1.5 17.72,44.3 17.85,44.42 20.34,44.42 20.45,44.31 20.45,20.65 22.52,18.58 v22.52,18.46
SCL  (via drill 0.2)
  Top 0.152: v23.57,4.32 24,3.89 Q4.1 | Q2.1 6.14,20.36 v6.22,20.45 | TP2.P$1 18.92,7.37 v18.03,6.48 | U9.P0.01 3.42,35.55 v2.3,35.55 | v4.7,12.74 4.98,13.03 Q1.1
  Top 0.203: v18.03,6.48 17.78,6.22 17.78,5.79 Q3.1
  Route2 0.152: v18.03,6.48 10.79,6.48 4.62,12.65 4.62,12.66 | v2.3,35.55 1.14,34.39 1.14,25.93 4.06,23.01 4.06,22.99 4.95,22.1 4.95,21.43 5.18,21.21 5.46,21.21 v6.22,20.45 | 4.62,15.56 4.62,12.66 | 4.62,12.66 v4.7,12.74
  Route2 0.203: v23.57,4.32 21.41,6.48 v18.03,6.48 | v6.22,20.45 6.22,17.16 4.62,15.56
SD_ENABLE  (via drill 0.2)
  Top 0.152: v4.06,40.51 3.48,40.51 U9.P0.28 | R16.1 23.57,35.06 23,35.63 U11.3 22.29,36.26 v22.23,36.2
  Route2 0.152: v4.06,40.51 7.27,40.51 15.65,32.13 18.16,32.13 v22.23,36.2
SDA  (via drill 0.2)
  Top 0.152: Q3.4 17.05,4.78 16.77,4.5 v16.58,4.5 | Q4.4 25.5,4.74 | 25.5,4.74 26.16,4.08 v26.16,2.41 | v2.67,36.07 3.4,36.07 U9.P0.00 | 25.5,4.74 25.83,5.08 TP1.P$1
  Top 0.203: Q2.4 4.65,19.18 v4.32,19.18 | Q1.4 6.02,14.61 v6.35,14.61
  Route2 0.152: v3.68,22.86 0.76,25.77 0.76,34.54 2.29,36.07 v2.67,36.07
  Route2 0.203: v16.58,4.5 19.12,4.5 22.23,1.4 25.53,1.4 26.16,2.03 v26.16,2.41
  Route15 0.152: v6.35,14.61 7.11,14.61 16.07,5.64 16.07,5.01 v16.58,4.5
  Bottom 0.152: v3.68,22.86 3.8,22.73 3.81,22.73
  Bottom 0.203: v6.35,14.61 4.7,16.26 4.7,18.8 v4.32,19.18 4.32,22.23 3.81,22.73
SIM_1V8  (via drill 0.2)
  Top 0.152: v17.02,39.62 17.27,39.62 17.64,39.26 U13.5 | v15.62,45.59 15.62,45.72 15.33,46.01 U9.SIM_1V8
  Route15 0.152: v17.02,39.62 16.13,39.62 15.62,40.13 v15.62,45.59
  Bottom 0.152: J2.C1 15.21,37.08 17.02,38.89 v17.02,39.62
SIM_CLK
  Top 0.152: U9.SIM_CLK 13.59,44.5 13.97,44.88 14.3,44.88 15.24,43.94 15.24,40.39 16.64,38.98 U13.7
SIM_CLK2  (via drill 0.2)
  Top 0.152: U13.2 16.64,37.21 v16.76,37.08
  Bottom 0.152: v16.76,37.08 15.97,37.08 14.07,35.18 12.47,35.18 12.23,34.94 12.23,34.15 13.05,33.32 J2.C3
SIM_IO
  Top 0.152: U9.SIM_IO 13.59,45.5 13.85,45.75 14.44,45.75 15.62,44.58 15.62,40.45 17.14,38.93 U13.6
SIM_IO2  (via drill 0.2)
  Top 0.152: v18.29,33.53 18.29,32.89 17.4,32 v14.73,32 | v17.65,36.96 17.14,37.47 U13.3
  Bottom 0.152: TP28.P$1 J2.C7 13.56,31.5 14.22,31.5 v14.73,32 | v18.29,33.53 18.29,36.32 v17.65,36.96
SIM_RST
  Top 0.152: U13.8 14.86,40.12 14.86,42.04 13.9,43 U9.SIM_RST
SIM_RST2  (via drill 0.2)
  Top 0.152: v16.24,36.56 16.14,36.67 U13.1
  Bottom 0.152: TP27.P$1 17.03,36.56 v16.24,36.56 16.21,36.56 15.75,36.1 15.75,35.6 15.08,34.93 13.44,34.93 J2.C2
SW
  Top 0.152: TP24.P$1 L4.P$2
  pour Top: 21.84,42.04 21.59,42.04 21.59,40.51 25.53,40.51 25.53,42.93 24,42.93 24,41.02 23.88,40.89 21.97,40.89 21.84,41.02
SWDCLK  (via drill 0.2)
  Top 0.152: J3.4 22.99,27.56 v21.84,26.42 | U9.SWDCLK 13.57,38.1 13.98,38.1 v14.04,38.04
  Route15 0.152: v14.04,38.04 15.49,36.59 15.49,30.86 19.94,26.42 v21.84,26.42
SWDIO  (via drill 0.2)
  Top 0.152: U9.SWDIO 13.57,38.61 v14.01,38.61 | J3.2 23.62,26.16 v22.99,26.16
  Route15 0.152: v14.01,38.61 15.75,36.87 15.75,31.02 19.97,26.8 22.23,26.8 22.86,26.16 v22.99,26.16
VBAT  (via drill 0.2)
  Top 0.152: U3.14 17.63,52.55 v17.4,52.32 | v14.73,34.42 14.35,34.04 13.5,34.04 U9.P0.15
  Top 0.254: Q6.6 18.83,47.32 v18.83,47.88
  Top 0.406: v18.8,37.59 18.8,32.1 18.41,31.72 v18.41,31.75 | BT2.2 14.48,22.61 12.32,20.45 v12.32,12.95
  Route2 0.406: v18.83,47.88 v18.82,47.87 18.8,38.48 v18.8,37.59 | BT2.2 15.37,28.7 v18.41,31.75
  Route15 0.356: v17.4,52.32 17.4,52.07 18.8,50.67 v18.83,47.88
  Bottom 0.406: BT2.2 14.48,29.84 15.75,31.11 15.75,33.78 15.11,34.42 v14.73,34.42 | BT2.1 12.32,5.46 v12.32,12.95
VBAT_OK  (via drill 0.2)
  Top 0.152: v17.4,53.09 17.43,53.05 U3.13 | v13.97,39.12 13.95,39.13 13.73,39.13 13.59,39 U9.P0.20
  Route15 0.152: v17.4,53.09 16.13,53.09 14.48,51.44 14.48,39.24 14.35,39.12 v13.97,39.12
VCC  (via drill 0.2)
  Top 0.152: Q7.4 21.46,1.76 v21.46,1.14 | Q7.1 19.99,3.17 v19.68,3.17 | U9.VDD@2 3.42,32.45 | 2.34,30.1 R10.1 | 6.35,15.44 v6.35,15.37 | R7.2 22.23,58.85 18.54,58.85 | 18.54,58.85 D2.1 | v18.54,58.8 18.54,58.85 | C10.1 16.76,13.51 v16.76,14.09 | U9.VDD@1 13.48,32.51 | v25.15,18.8 25.15,18.29 U5.10 | v26.04,20.45 26.01,20.42 25.13,20.42 | v25.78,25.53 J3.1 | v19.43,39.62 19.43,40.5 C18.1 | R9.2 10.77,13.77 R8.2 11.05,14.22 v10.67,14.61 | R6.2 21.54,7.52 R5.2 20.95,9.22 v20.95,9.4 | U11.6 U11.5 25.53,37.21 25.91,36.83 25.91,35.18 25.53,34.8 R16.2 24.44,33.22 v24.51,33.15 | U9.VDD_GPIO 8.97,29.56 C15.1 8.26,30.28 v8.26,30.73 | U1.13 15.22,13.34 | TP25.P$1 v21.84,30.86
  Top 0.203: 15.22,13.34 C10.1 | C7.1 C6.1 | 25.13,20.42 C19.1 | U5.9 25.65,17.78 25.65,18.29 25.64,18.28 U5.10 | Q8.4 6.35,15.44 | Q9.1 8.73,11.46 v9.02,11.18 9.35,11.18 R26.2
  Top 0.254: C9.1 C8.1 C4.1 23.62,5.79 v23.62,6.1 | R22.2 21.13,6.86 R6.2 | C19.1 23.79,20.43 C5.1 23.67,20.39 22.79,21.28 R23.2 | R25.2 6.3,22.86 C7.1 | Q8.1 4.91,17.19 4.99,17.27 v5.33,17.27 | U2.2 v5.59,48.77 | C6.1 7.37,20.27 v7.37,19.56 7.37,18.98 R24.2
  Top 0.305: 3.42,32.45 3.12,32.45 3.06,32.4 3.06,30.99 | 2.34,30.1 C13.1 3.06,30.67 3.06,30.99 | v3.56,30.86 3.19,30.86 3.06,30.99 | 13.48,32.51 v14.73,32.51
  Route2 0.508: v19.18,30.86 v16.38,28.07
  Bottom 0.152: v6.35,15.37 9.02,12.7 v9.02,11.18
  other vias: 8.76,21.34
  pour Top (isolate 0.203, no thermals): 20.45,42.04 21.21,42.04 21.21,40.26 19.3,40.26 19.3,41.27 20.45,41.27
  pour Route15 (rank 2): 0,60 27,60 27,0 0,0
VOC_SAMP_VSTOR  (via drill 0.2)
  Top 0.152: v20.45,50.55 20.45,50.29 19.48,49.33 C3.1 | v22.48,53.09 22.45,53.05 U3.3
  Top 0.203: v20.45,50.55 20.44,50.78 U3.19 | Q5.6 17.19,51.12 17.89,51.12 18.16,50.85 C11.1
  Top 0.254: C3.1 19.05,49.45 C11.1
  Route2 0.152: v22.48,53.09 22.48,52.58 v20.45,50.55
VREF_SAMP
  Top 0.152: U3.4 21.81,53.68 23.13,53.68 C2.1
VSEC  (via drill 0.2)
  Top 0.203: U3.18 v19.94,50.51
  Top 0.254: U9.P0.13 15.42,33 BT1.+
  Route2 0.254: v19.94,50.51 19.94,37.52 BT1.+
VSOL  (via drill 0.2)
  Top 0.203: 14.45,33.5 U9.P0.14
  Top 0.254: v16.76,35.81 14.45,33.5
  Top 0.406: U3.2 22.34,52.55 24.99,49.91 D1.+
  Route15 0.152: D1.+ 25.27,41.81 19.27,35.81 v16.76,35.81
  pour Top (no thermals): 24,53.76 24,52.29 23.24,51.53 23.24,46.45 26.04,46.45 26.04,51.66 24.64,53.05 24.64,53.76
VSW  (via drill 0.2)
  Top 0.152: R21.2 19.18,44.34 21.59,44.34 21.86,44.61 C17.1
  Top 0.203: Q6.3 17.83,46.45 v17.4,46.45
  Top 0.254: v16.26,47.62 16.21,47.67 Q5.3
  Bottom 0.254: v16.26,47.62 16.26,47.34 17.14,46.45 v17.4,46.45 19.02,44.83 v22.86,44.83
  pour Top (isolate 0.203, no thermals): 21.59,43.05 21.59,46.1 25.53,46.1 25.53,43.94 21.84,43.94 21.84,43.05
WDI  (via drill 0.2)
  Top 0.152: v14.22,34.54 14.18,34.5 U9.P0.16 | v11.5,28.05 11.5,17.47 10.03,16 R9.1 9.6,13.89 9.33,13.62 9.33,12.94 10.21,12.06 10.92,12.06 | 10.92,12.06 U1.2 | TP16.P$1 10.92,12.06
  Bottom 0.152: v14.22,34.54 14.22,33.78 15.24,32.77 15.24,31.94 11.43,28.13 v11.5,28.05

## Text on the board
bPlace: SECONDARY
tNames: RESET | SOLAR | VCC | GND | Permamote_LTE / Meghna Mandava / 5/20 | A | SOLAR